# EAGLE design SUPERHOOP (EAGLE 6.4)
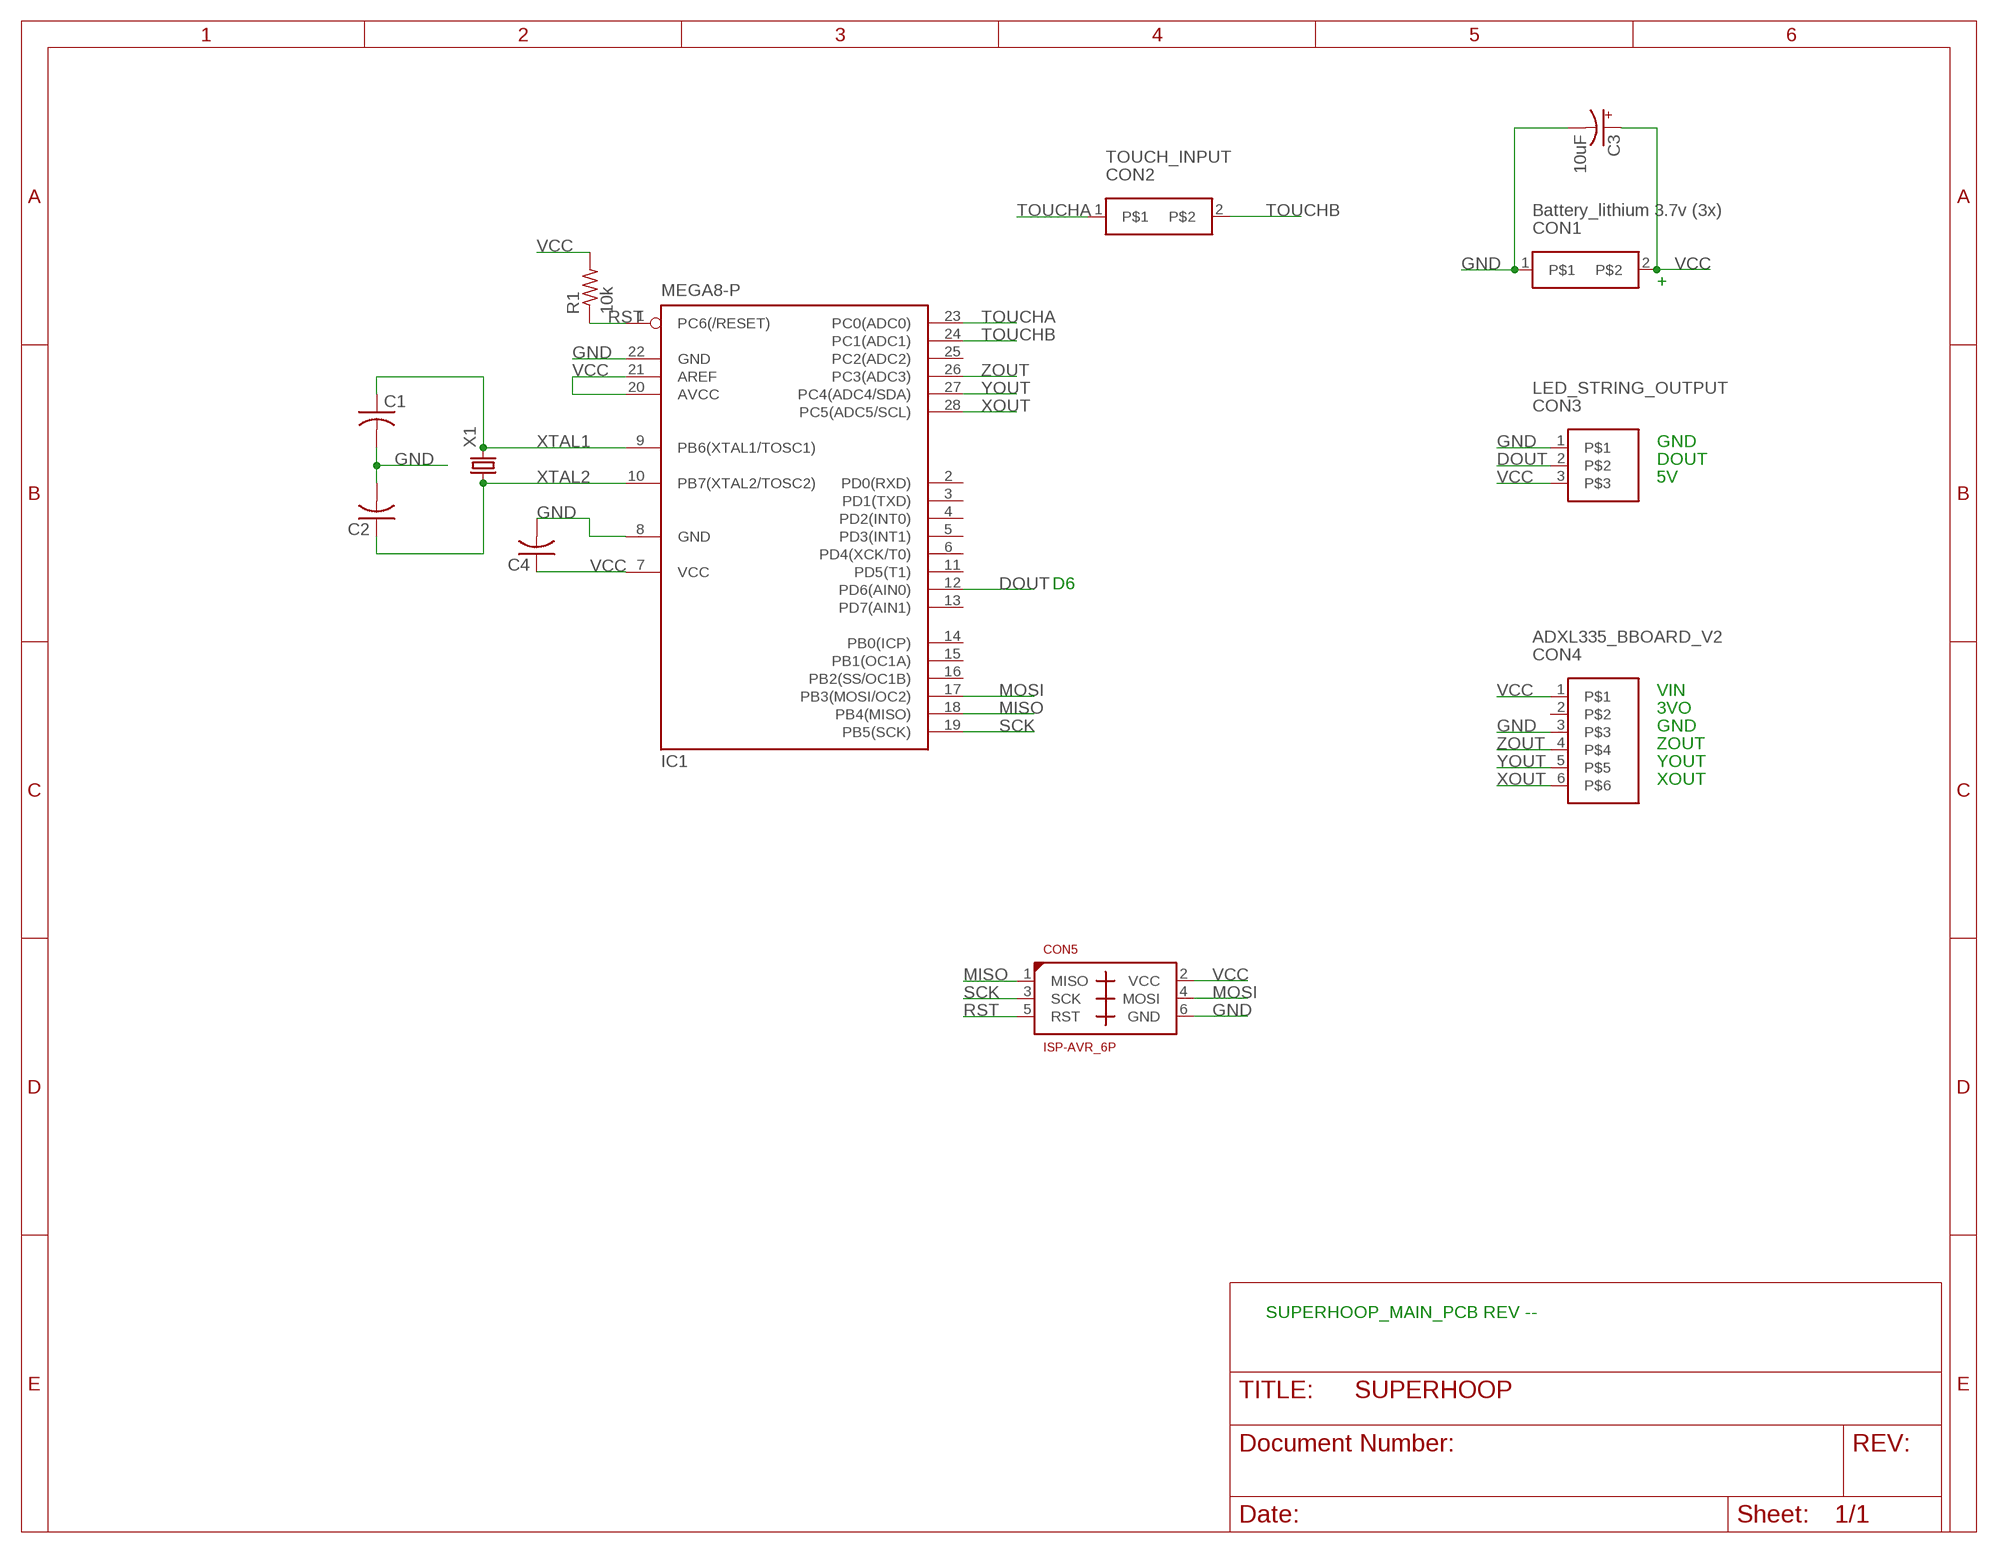
[diagram p0: schematic, sheet 1]

## Parts
C1  C-US025-024X044  [C025-024X044]
C2  C-US025-024X044  [C025-024X044]
C3  10uF  CPOL-USE2.5-5  [E2,5-5]
C4  C-US025-024X044  [C025-024X044]
CON1  Battery_lithium 3.7v (3x)  HEADER_2X1_2.54  [HEADER_2X1_2.54]
CON2  TOUCH_INPUT  HEADER_2X1_2.54  [HEADER_2X1_2.54]
CON3  LED_STRING_OUTPUT  HEADER_3X1  [HEADER_3X1_2.54]
CON4  ADXL335_BBOARD_V2  HEADER_6X1_2.54  [HEADER_6X1_2.54]
CON5  ISP-AVR_6P  [HEADER_3X2_2.54]
IC1  MEGA8-P  [DIL28-3]
R1  10k  R-US_0207/12  [0207/12]
X1  CRYSTALHC49S  [HC49/S]

## Nets
DOUT: CON3.2 IC1.12(PD6(AIN0))
GND: C1.2 C2.2 C3.- C4.2 CON1.1 CON3.1 CON4.3 CON5.6(GND) IC1.8(GND) IC1.22(GND)
MISO: CON5.1(MISO) IC1.18(PB4(MISO))
MOSI: CON5.4(MOSI) IC1.17(PB3(MOSI/OC2))
RST: CON5.5(RST) IC1.1(PC6(/RESET)) R1.1
SCK: CON5.3(SCK) IC1.19(PB5(SCK))
TOUCHA: CON2.1 IC1.23(PC0(ADC0))
TOUCHB: CON2.2 IC1.24(PC1(ADC1))
VCC: C3.+ C4.1 CON1.2 CON3.3 CON4.1 CON5.2(VCC) IC1.7(VCC) IC1.20(AVCC) IC1.21(AREF) R1.2
XOUT: CON4.6 IC1.28(PC5(ADC5/SCL))
XTAL1: C1.1 IC1.9(PB6(XTAL1/TOSC1)) X1.2
XTAL2: C2.1 IC1.10(PB7(XTAL2/TOSC2)) X1.1
YOUT: CON4.5 IC1.27(PC4(ADC4/SDA))
ZOUT: CON4.4 IC1.26(PC3(ADC3))
Unconnected: CON4.2 IC1.2(PD0(RXD)) IC1.3(PD1(TXD)) IC1.4(PD2(INT0)) IC1.5(PD3(INT1)) IC1.6(PD4(XCK/T0)) IC1.11(PD5(T1)) IC1.13(PD7(AIN1)) IC1.14(PB0(ICP)) IC1.15(PB1(OC1A)) IC1.16(PB2(SS/OC1B)) IC1.25(PC2(ADC2))

## Notes on the sheet
- +
- GND
- DOUT
- 5V
- D6
- VIN
- 3VO
- GND
- ZOUT
- YOUT
- XOUT
- SUPERHOOP_MAIN_PCB REV --

## Library data of the parts
C1 C2 C4 = rcl:C-US: CAPACITOR, American symbol
C3 = rcl:CPOL-US: POLARIZED CAPACITOR, American symbol
CON1 CON2 = daneagle_db:HEADER_2X1
CON3 = daneagle_db:HEADER_3X1
CON4 = daneagle_db:HEADER_6X1
CON5 = daneagle_db:ISP-AVR
IC1 = atmel:MEGA8-P: MICROCONTROLLER 8 Kbytes FLASH, 1 kbytes SRAM, 512 bytes EEPROM, USART, 4-channel 10 bit ADC, 2-channel 8 bit ADC Pin compatible with Atmega48, ATMega88, ATMega168 Source: avr.lbr; OC_FARNELL: unknown; OC_NEWARK: unknown
R1 = rcl:R-US_: RESISTOR, American symbol
X1 = crystal:CRYSTAL: CRYSTAL; OC_FARNELL: 1667008; OC_NEWARK: unknown

## Board
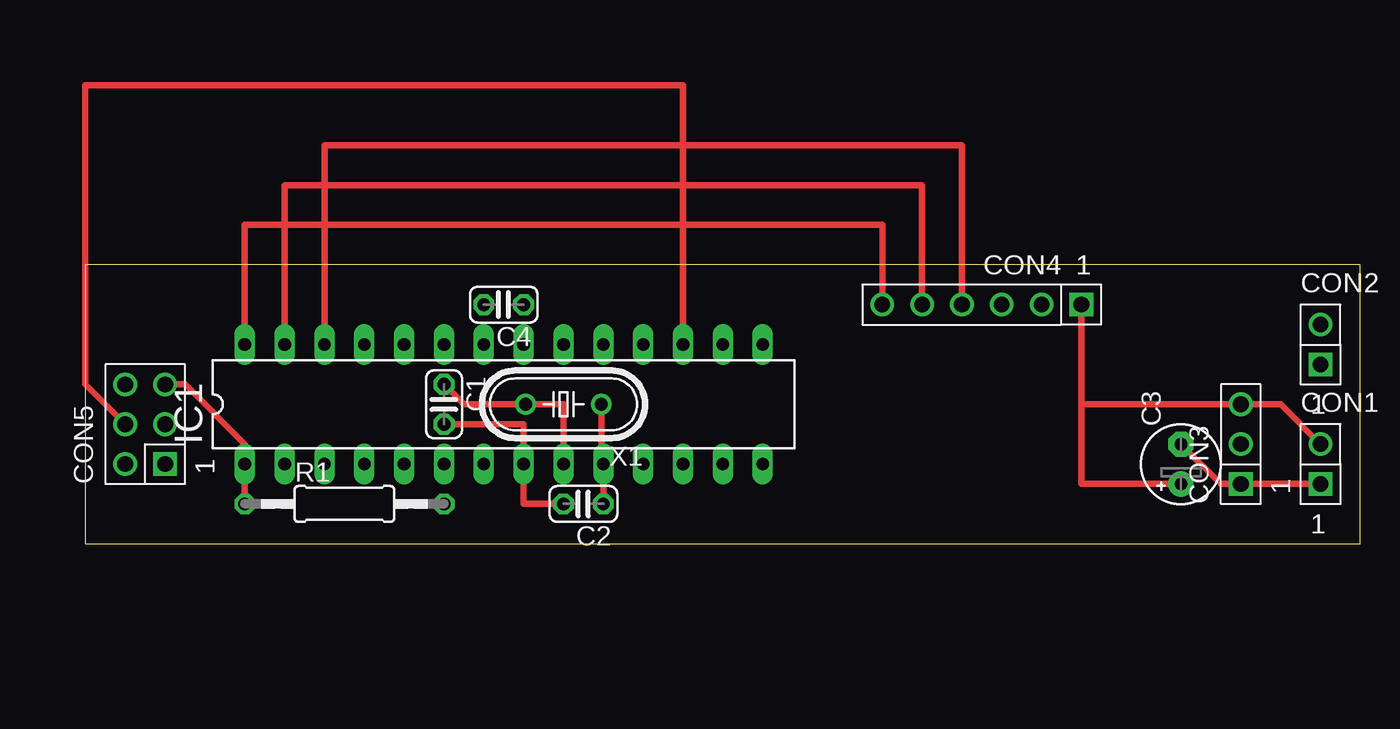
[diagram p1: board, top side]
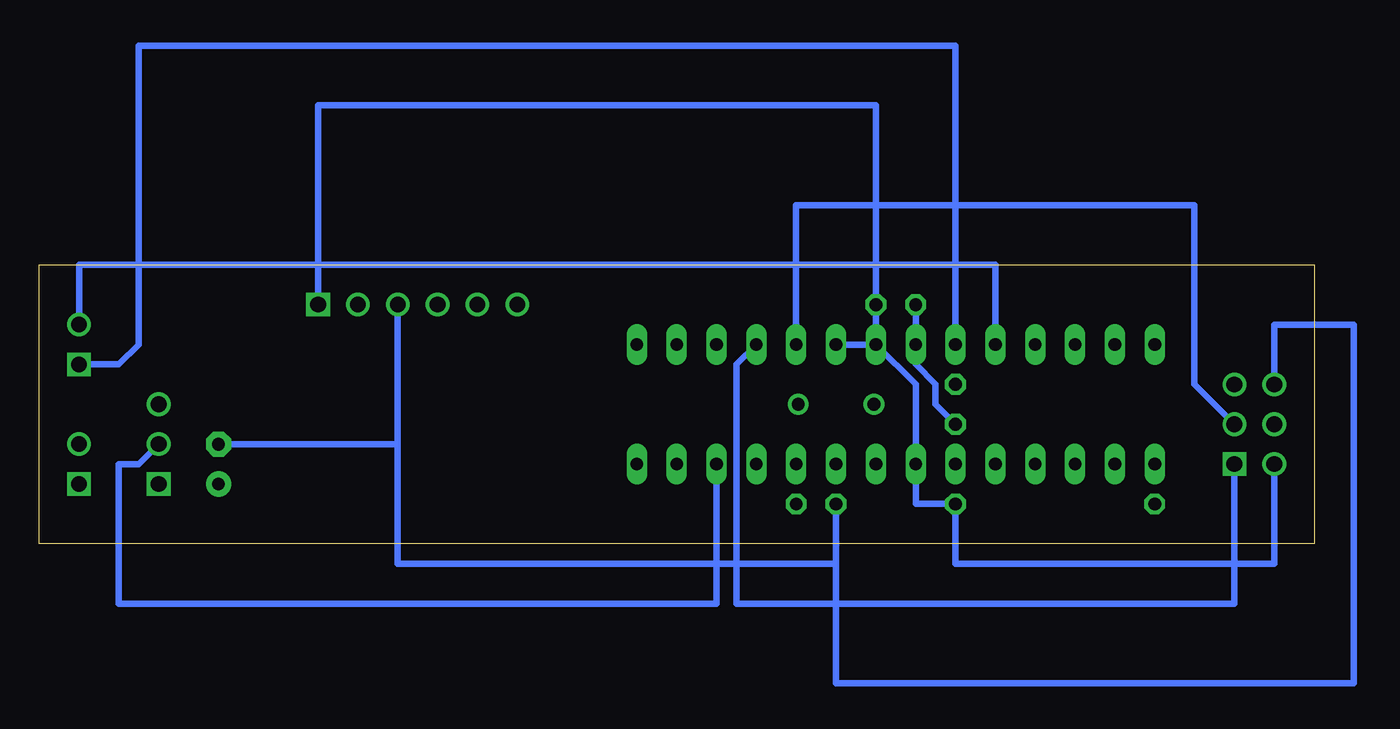
[diagram p2: board, bottom side, seen from below]

Size 81.28 x 17.78 mm. Coordinates in mm from the lower left corner, seen from the top.
Outline: 0,0 81.28,0 81.28,17.78 0,17.78 0,0
Copper layers (1*16): Top 0.035mm / dielectric 1.5mm / Bottom 0.035mm
Design rules "default": minimum track width 10mil, minimum drill 24mil, track to track 8mil, track to pad 8mil, pad to pad 8mil, via to via 8mil, smd to smd 8mil, copper to edge 40mil, drill to drill 8mil, minimum pad ring 10mil, minimum via ring 8mil, stop-mask expansion 4mil, vias tented up to drill 0mil, thermal gap 10mil

### Footprints (pad centres in the part's own frame; a part is rotated, then mirrored left to right if it is on the bottom)
C025-024X044 = drill 0.813 octagon: 1 -1.27,0; 2 1.27,0
E2,5-5 = drill 0.813 pad 1.6: + -1.27,0 | drill 0.813 pad 1.6 octagon: - 1.27,0
HEADER_2X1_2.54 = drill 1 pad 1.422 square: 1 0,-1.27 | drill 1 pad 1.422: 2 0,1.27
HEADER_3X1_2.54 = drill 1 pad 1.422 square: 1 -2.54,0 | drill 1 pad 1.422: 2 0,0; 3 2.54,0
HEADER_6X1_2.54 = drill 1 pad 1.422 square: 1 -6.35,0 | drill 1 pad 1.422: 2 -3.81,0; 3 -1.27,0; 4 1.27,0; 5 3.81,0; 6 6.35,0
HEADER_3X2_2.54 = drill 1 pad 1.422 square: 1 -2.54,-1.27 | drill 1 pad 1.422: 2 -2.54,1.27; 3 0,-1.27; 4 0,1.27; 5 2.54,-1.27; 6 2.54,1.27
DIL28-3 = drill 0.813 long: 1 -16.51,-3.81; 2 -13.97,-3.81; 3 -11.43,-3.81; 4 -8.89,-3.81; 5 -6.35,-3.81; 6 -3.81,-3.81; 7 -1.27,-3.81; 8 1.27,-3.81; 9 3.81,-3.81; 10 6.35,-3.81; 11 8.89,-3.81; 12 11.43,-3.81; 13 13.97,-3.81; 14 16.51,-3.81; 15 16.51,3.81; 16 13.97,3.81; 17 11.43,3.81; 18 8.89,3.81; 19 6.35,3.81; 20 3.81,3.81; 21 1.27,3.81; 22 -1.27,3.81; 23 -3.81,3.81; 24 -6.35,3.81; 25 -8.89,3.81; 26 -11.43,3.81; 27 -13.97,3.81; 28 -16.51,3.81
0207/12 = drill 0.813 octagon: 1 -6.35,0; 2 6.35,0
HC49/S = drill 0.813: 1 -2.413,0; 2 2.413,0

### Placement (x,y rotation side)
C1  22.86,8.89 270 top
C2  31.75,2.54 180 top
C3  69.85,5.08 90 top
C4  26.67,15.24 180 top
CON1  78.74,5.08 0 top
CON2  78.74,12.7 0 top
CON3  73.66,6.35 90 top
CON4  57.15,15.24 180 top
CON5  3.81,7.62 90 top
IC1  26.67,8.89 0 top
R1  16.51,2.54 0 top
X1  30.48,8.89 180 top

### Tracks (layer width: path | path; a pad name or v marks a point on that pad's centre or on a via)
DOUT
  Bottom 0.406: IC1.12 38.1,-3.81 76.2,-3.81 76.2,5.08 74.93,5.08 CON3.2
GND
  Top 0.406: C2.2 27.94,2.54 IC1.8 27.94,7.62 C1.2 | CON1.1 CON3.1 72.39,3.81 C3.-
  Bottom 0.406: C4.2 IC1.22 25.4,11.43 24.13,10.16 24.13,8.89 C1.2 | 58.42,6.35 C3.- | CON4.3 58.42,6.35 | 58.42,6.35 58.42,-1.27 30.48,-1.27 | 30.48,-1.27 C2.2 | CON5.6 2.54,13.97 -2.54,13.97 -2.54,-8.89 30.48,-8.89 30.48,-1.27
MISO
  Bottom 0.406: CON5.1 5.08,-3.81 36.83,-3.81 36.83,11.43 IC1.18
MOSI
  Top 0.406: CON5.4 0,10.16 0,29.21 38.1,29.21 IC1.17
RST
  Top 0.406: R1.1 IC1.1 10.16,6.35 6.35,10.16 CON5.5
SCK
  Bottom 0.406: CON5.3 7.62,10.16 7.62,21.59 33.02,21.59 IC1.19
TOUCHA
  Bottom 0.406: CON2.1 76.2,11.43 74.93,12.7 74.93,31.75 22.86,31.75 IC1.23
TOUCHB
  Bottom 0.406: IC1.24 20.32,17.78 78.74,17.78 CON2.2
VCC
  Top 0.406: 63.5,8.89 CON4.1 | 63.5,8.89 CON3.3 76.2,8.89 CON1.2 | 63.5,8.89 63.5,3.81 C3.+
  Bottom 0.406: IC1.21 25.4,10.16 IC1.7 25.4,2.54 R1.2 22.86,-1.27 2.54,-1.27 CON5.2 | IC1.21 C4.1 27.94,27.94 63.5,27.94 CON4.1 | IC1.21 IC1.20
XOUT
  Top 0.406: IC1.28 10.16,20.32 50.8,20.32 CON4.6
XTAL1
  Top 0.406: IC1.9 30.48,8.89 X1.2 24.13,8.89 C1.1
XTAL2
  Top 0.406: C2.1 IC1.10 32.89,5.08 X1.1
YOUT
  Top 0.406: IC1.27 12.7,22.86 53.34,22.86 CON4.5
ZOUT
  Top 0.406: IC1.26 15.24,25.4 55.88,25.4 CON4.4